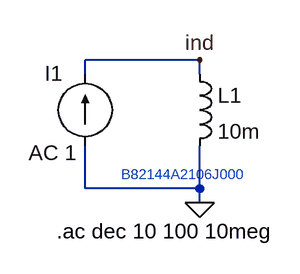
[diagram p0: schematic 07-inductor_chacteristics.asc]
07-inductor_chacteristics.asc, the LTspice schematic file:
Version 4
SHEET 1 880 680
WIRE 144 48 16 48
WIRE 16 64 16 48
WIRE 144 64 144 48
WIRE 16 192 16 144
WIRE 144 192 144 144
WIRE 144 192 16 192
WIRE 144 208 144 192
FLAG 144 208 0
FLAG 144 48 ind
SYMBOL ind 128 48 R0
SYMATTR InstName L1
SYMATTR Value 10m
SYMATTR SpiceLine Rser=42 Cpar=3p
SYMBOL current 16 144 R180
WINDOW 0 25 81 Left 2
WINDOW 3 24 0 Left 2
WINDOW 123 10 -8 Left 2
WINDOW 39 0 0 Left 0
SYMATTR InstName I1
SYMATTR Value ""
SYMATTR Value2 AC 1
TEXT -16 240 Left 2 !.ac dec 10 100 10meg
TEXT 56 176 Left 1 ;B82144A2106J000

The netlist it stands for:
* 07-inductor_chacteristics.asc
L1 ind 0 10m Rser=42 Cpar=3p
I1 0 ind AC 1
.ac dec 10 100 10meg
* B82144A2106J000
.backanno
.end

* Results of the author's LTspice run, read from the files saved beside the schematic
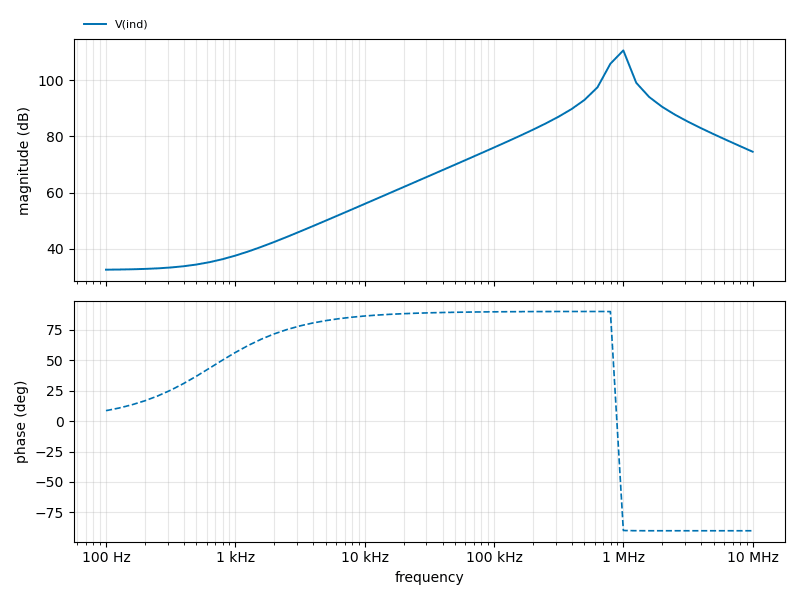
[diagram p1: AC Analysis of 07-inductor_chacteristics.asc, plotted from the saved traces]
* AC Analysis, 1 run:
*   V(ind): 32.56 dB at 100 Hz, 74.57 dB at 10 MHz, peak 110.65 dB at 1 MHz, 3 dB below the peak at 864 kHz and 1.062 MHz